# Altium project CRD25DA12N-FMC V2 (09-2024).PrjPcb (part 7 of 9)

## Sheet 07 - Current-Temp Sense.SchDoc: Current/Temp. - 25kW WolfPACK FM3 Six-Pack Inv.
size 431 x 279 mm; Date: 09/2024; DocumentNumber: CRD25DA12N-FMC; Revision: 2.0; SheetNumber: 7; SheetTotal: 9; SheetSize: B
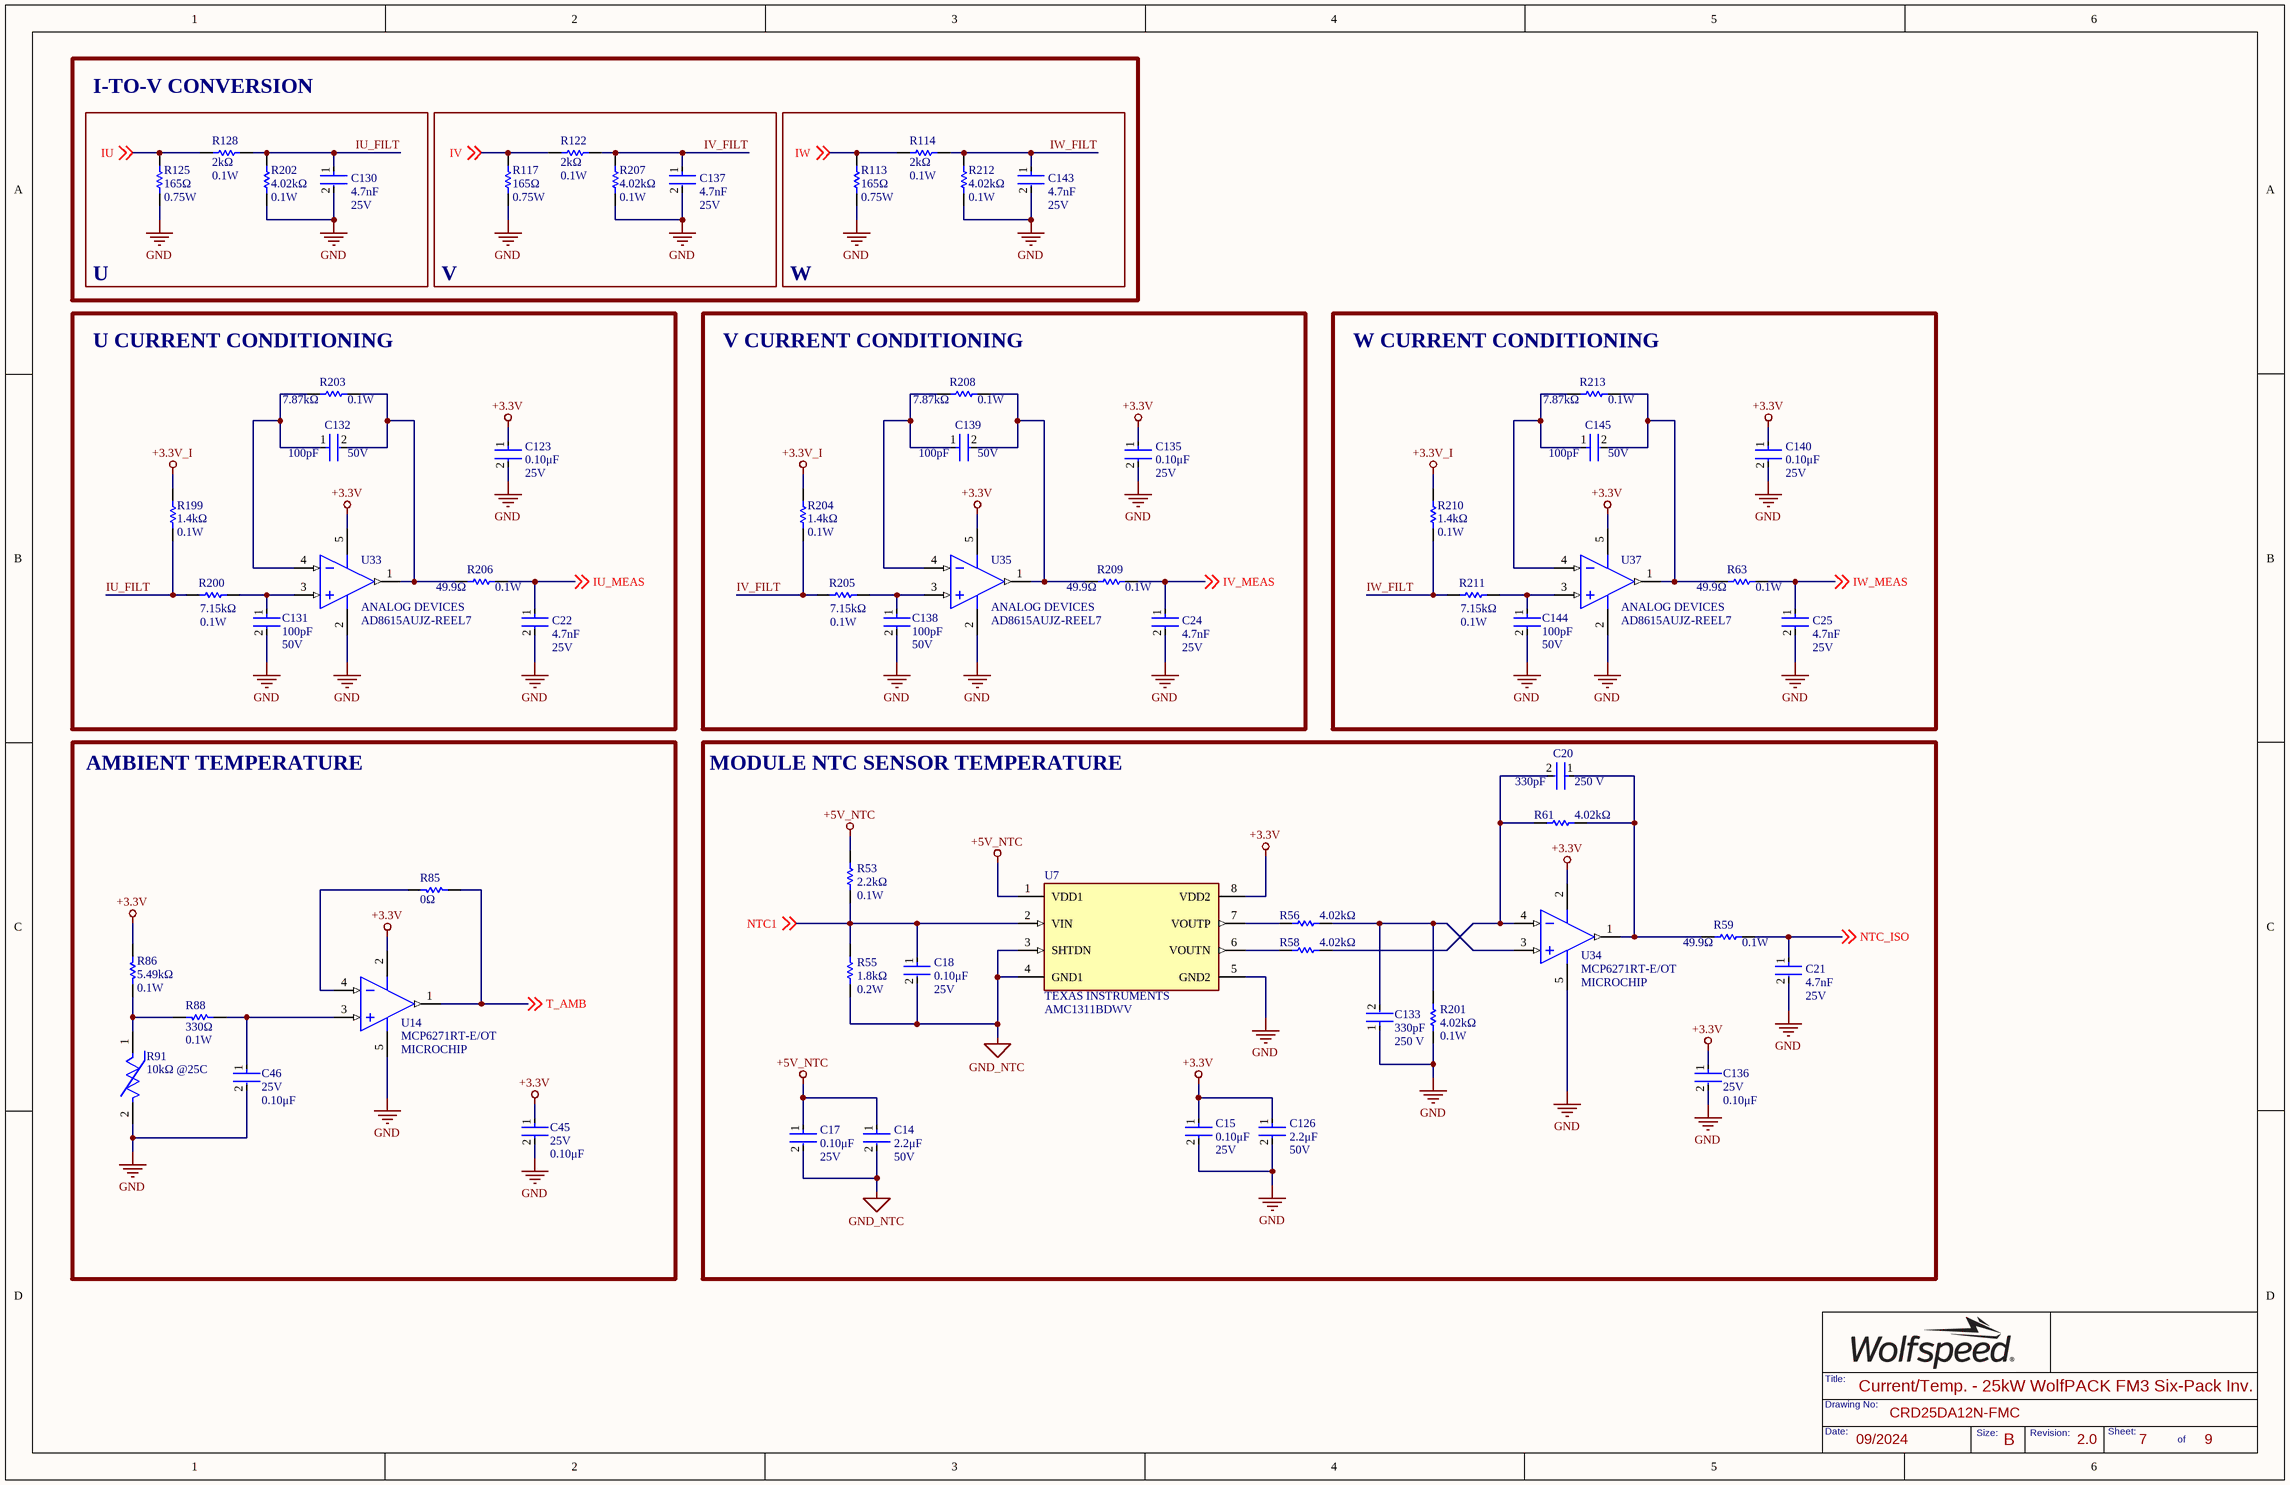
[diagram p6: 07 - Current-Temp Sense.SchDoc]

### Parts
C14  Voltage Rating: 50V  Capacitance: 2.2μF  [FP-C0603C-CF-IPC_B]  (hidden comment: GRT188R61H225ME13D)
C15  Voltage Rating: 25V  Capacitance: 0.10μF  [FP-C0603C-CF-IPC_B]  (hidden comment: C0603C104K3RACTU)
C17  Voltage Rating: 25V  Capacitance: 0.10μF  [FP-C0603C-CF-IPC_B]  (hidden comment: C0603C104K3RACTU)
C18  Voltage Rating: 25V  Capacitance: 0.10μF  [FP-C0603C-CF-IPC_B]  (hidden comment: C0603C104K3RACTU)
C20  value 330pF  Voltage Rating: 250 V  [FP-C0603C-CF-IPC_B]  (hidden comment: C0603C331JAGAC7867)
C21  Voltage Rating: 25V  Capacitance: 4.7nF  [FP-C0603C-CF-IPC_B]  (hidden comment: C0603C472K3RAC7867)
C22  Voltage Rating: 25V  Capacitance: 4.7nF  [FP-C0603C-CF-IPC_B]  (hidden comment: C0603C472K3RAC7867)
C24  Voltage Rating: 25V  Capacitance: 4.7nF  [FP-C0603C-CF-IPC_B]  (hidden comment: C0603C472K3RAC7867)
C25  Voltage Rating: 25V  Capacitance: 4.7nF  [FP-C0603C-CF-IPC_B]  (hidden comment: C0603C472K3RAC7867)
C45  Voltage Rating: 25V  Capacitance: 0.10μF  [FP-C0603C-CF-IPC_B]  (hidden comment: C0603C104K3RACTU)
C46  Voltage Rating: 25V  Capacitance: 0.10μF  [FP-C0603C-CF-IPC_B]  (hidden comment: C0603C104K3RACTU)
C123  Voltage Rating: 25V  Capacitance: 0.10μF  [FP-C0603C-CF-IPC_B]  (hidden comment: C0603C104K3RACTU)
C126  Voltage Rating: 50V  Capacitance: 2.2μF  [FP-C0603C-CF-IPC_B]  (hidden comment: GRT188R61H225ME13D)
C130  Voltage Rating: 25V  Capacitance: 4.7nF  [FP-C0603C-CF-IPC_B]  (hidden comment: C0603C472K3RAC7867)
C131  Capacitance: 100pF  Voltage: 50V  [FP-C0603C-CF-IPC_B]  (hidden comment: CL10C101JB8NNNC)
C132  Capacitance: 100pF  Voltage: 50V  [FP-C0603C-CF-IPC_B]  (hidden comment: CL10C101JB8NNNC)
C133  value 330pF  Voltage Rating: 250 V  [FP-C0603C-CF-IPC_B]  (hidden comment: C0603C331JAGAC7867)
C135  Voltage Rating: 25V  Capacitance: 0.10μF  [FP-C0603C-CF-IPC_B]  (hidden comment: C0603C104K3RACTU)
C136  Voltage Rating: 25V  Capacitance: 0.10μF  [FP-C0603C-CF-IPC_B]  (hidden comment: C0603C104K3RACTU)
C137  Voltage Rating: 25V  Capacitance: 4.7nF  [FP-C0603C-CF-IPC_B]  (hidden comment: C0603C472K3RAC7867)
C138  Capacitance: 100pF  Voltage: 50V  [FP-C0603C-CF-IPC_B]  (hidden comment: CL10C101JB8NNNC)
C139  Capacitance: 100pF  Voltage: 50V  [FP-C0603C-CF-IPC_B]  (hidden comment: CL10C101JB8NNNC)
C140  Voltage Rating: 25V  Capacitance: 0.10μF  [FP-C0603C-CF-IPC_B]  (hidden comment: C0603C104K3RACTU)
C143  Voltage Rating: 25V  Capacitance: 4.7nF  [FP-C0603C-CF-IPC_B]  (hidden comment: C0603C472K3RAC7867)
C144  Capacitance: 100pF  Voltage: 50V  [FP-C0603C-CF-IPC_B]  (hidden comment: CL10C101JB8NNNC)
C145  Capacitance: 100pF  Voltage: 50V  [FP-C0603C-CF-IPC_B]  (hidden comment: CL10C101JB8NNNC)
R53  value 2.2kΩ  Power: 0.1W  [FP-MCR03-IPC_B]  (hidden comment: RC0603FR-072K2L)
R55  Resistance: 1.8kΩ  Max Power Dissipation: 0.2W  [FP-MCR03-IPC_B]  (hidden comment: ERJ-PB3B1801V)
R56  Resistance: 4.02kΩ  [FP-MCR03-IPC_B]  (hidden comment: ERA3AEB4021V)
R58  Resistance: 4.02kΩ  [FP-MCR03-IPC_B]  (hidden comment: ERA3AEB4021V)
R59  Resistance: 49.9Ω  Power Rating: 0.1W  [FP-MCR03-IPC_B]  (hidden comment: ERJ-3EKF49R9V)
R61  Resistance: 4.02kΩ  [FP-MCR03-IPC_B]  (hidden comment: ERA3AEB4021V)
R63  Resistance: 49.9Ω  Power Rating: 0.1W  [FP-MCR03-IPC_B]  (hidden comment: ERJ-3EKF49R9V)
R85  Resistance: 0Ω  [FP-MCR03-IPC_B]  (hidden comment: CRCW06030000Z0EB)
R86  value 5.49kΩ  Power Rating: 0.1W  [FP-MCR03-IPC_B]  (hidden comment: RC0603FR-075K49L)
R88  Resistance: 330Ω  Power Rating: 0.1W  [FP-MCR03-IPC_B]  (hidden comment: RC0603FR-13330RL)
R91  value 10kΩ @25C  [FP-NCU18-0_15-IPC_B]  (hidden comment: NCU18XH103F6SRB)
R113  value 165Ω  Power: 0.75W  [FP-CRCW2010-e3-IPC_B]  (hidden comment: CRCW2010165RFKEF)
R114  Resistance: 2kΩ  Power Rating: 0.1W  [FP-MCR03-IPC_B]  (hidden comment: RT0603DRE072KL)
R117  value 165Ω  Power: 0.75W  [FP-CRCW2010-e3-IPC_B]  (hidden comment: CRCW2010165RFKEF)
R122  Resistance: 2kΩ  Power Rating: 0.1W  [FP-MCR03-IPC_B]  (hidden comment: RT0603DRE072KL)
R125  value 165Ω  Power: 0.75W  [FP-CRCW2010-e3-IPC_B]  (hidden comment: CRCW2010165RFKEF)
R128  Resistance: 2kΩ  Power Rating: 0.1W  [FP-MCR03-IPC_B]  (hidden comment: RT0603DRE072KL)
R199  value 1.4kΩ  Power: 0.1W  [FP-MCR03-IPC_B]  (hidden comment: RT0603DRD071K4L)
R200  Resistance: 7.15kΩ  Power Rating: 0.1W  [FP-MCR03-IPC_B]  (hidden comment: RMCF0603FT7K15)
R201  Power: 0.1W  Resistance: 4.02kΩ  [FP-MCR03-IPC_B]  (hidden comment: ERA3AEB4021V)
R202  Resistance: 4.02kΩ  Power Rating: 0.1W  [FP-MCR03-IPC_B]  (hidden comment: ERA3AEB4021V)
R203  Resistance: 7.87kΩ  Max Power Dissipation: 0.1W  [FP-MCR03-IPC_B]  (hidden comment: RC0603FR-077K87L)
R204  value 1.4kΩ  Power: 0.1W  [FP-MCR03-IPC_B]  (hidden comment: RT0603DRD071K4L)
R205  Resistance: 7.15kΩ  Power Rating: 0.1W  [FP-MCR03-IPC_B]  (hidden comment: RMCF0603FT7K15)
R206  Resistance: 49.9Ω  Power Rating: 0.1W  [FP-MCR03-IPC_B]  (hidden comment: ERJ-3EKF49R9V)
R207  Resistance: 4.02kΩ  Power Rating: 0.1W  [FP-MCR03-IPC_B]  (hidden comment: ERA3AEB4021V)
R208  Resistance: 7.87kΩ  Max Power Dissipation: 0.1W  [FP-MCR03-IPC_B]  (hidden comment: RC0603FR-077K87L)
R209  Resistance: 49.9Ω  Power Rating: 0.1W  [FP-MCR03-IPC_B]  (hidden comment: ERJ-3EKF49R9V)
R210  value 1.4kΩ  Power: 0.1W  [FP-MCR03-IPC_B]  (hidden comment: RT0603DRD071K4L)
R211  Resistance: 7.15kΩ  Power Rating: 0.1W  [FP-MCR03-IPC_B]  (hidden comment: RMCF0603FT7K15)
R212  Resistance: 4.02kΩ  Power Rating: 0.1W  [FP-MCR03-IPC_B]  (hidden comment: ERA3AEB4021V)
R213  Resistance: 7.87kΩ  Max Power Dissipation: 0.1W  [FP-MCR03-IPC_B]  (hidden comment: RC0603FR-077K87L)
U7  AMC1311BDWV  Manufacturer: TEXAS INSTRUMENTS  [FP-DWV0008A-MFG]
U14  Manufacturer: MICROCHIP  [ADI-UJ-5_M]  (hidden comment: MCP6271RT-E/OT)
U33  Manufacturer: ANALOG DEVICES  [ADI-UJ-5_M]  (hidden comment: AD8615AUJZ-REEL7)
U34  Manufacturer: MICROCHIP  [ADI-UJ-5_M]  (hidden comment: MCP6271RT-E/OT)
U35  Manufacturer: ANALOG DEVICES  [ADI-UJ-5_M]  (hidden comment: AD8615AUJZ-REEL7)
U37  Manufacturer: ANALOG DEVICES  [ADI-UJ-5_M]  (hidden comment: AD8615AUJZ-REEL7)

### Blocks framed on the sheet
V: C137 R117 R122 R207
W: C143 R113 R114 R212
U CURRENT CONDITIONING: C22 C123 C131 C132 R199 R200 R203 R206 U33
V CURRENT CONDITIONING: C24 C135 C138 C139 R204 R205 R208 R209 U35
W CURRENT CONDITIONING: C25 C140 C144 C145 R63 R210 R211 R213 U37
AMBIENT TEMPERATURE: C45 C46 R85 R86 R88 R91 U14
MODULE NTC SENSOR TEMPERATURE: C14 C15 C17 C18 C20 C21 C126 C133 C136 R53 R55 R56 R58 R59 R61 R201 U7 U34

### Nets
+3.3V: C15.1 C45.1 C123.1 C126.1 C135.1 C136.1 C140.1 R86.2 U7.8(VDD2) U14.2(+V) U33.5(+V) U34.2(+V) U35.5(+V) U37.5(+V)
+3.3V_I: R199.2 R204.2 R210.2
+5V_NTC: C14.1 C17.1 R53.2 U7.1(VDD1)
GND: C15.2 C21.2 C22.2 C24.2 C25.2 C45.2 C46.2 C123.2 C126.2 C130.2 C131.2 C133.1 C135.2 C136.2 C137.2 C138.2 C140.2 C143.2 C144.2 R91.2 R113.1 R117.1 R125.1 R201.2 R202.1 R207.1 R212.1 U7.5(GND2) U14.5(-V) U33.2(-V) U34.5(-V) U35.2(-V) U37.2(-V)
GND_NTC: C14.2 C17.2 C18.2 R55.1 U7.3(SHTDN) U7.4(GND1)
IU: R125.2 R128.1 ; off-sheet IU
IU_FILT: C130.1 R128.2 R199.1 R200.1 R202.2
IU_MEAS: C22.1 R206.2 ; off-sheet IU_MEAS
IV: R117.2 R122.1 ; off-sheet IV
IV_FILT: C137.1 R122.2 R204.1 R205.1 R207.2
IV_MEAS: C24.1 R209.2 ; off-sheet IV_MEAS
IW: R113.2 R114.1 ; off-sheet IW
IW_FILT: C143.1 R114.2 R210.1 R211.1 R212.2
IW_MEAS: C25.1 R63.2 ; off-sheet IW_MEAS
NTC1: C18.1 R53.1 R55.2 U7.2(VIN) ; off-sheet NTC1
NTC_ISO: C21.1 R59.2 ; off-sheet NTC_ISO
T_AMB: R85.1 U14.1(OUT) ; off-sheet T_AMB
NetC20_1: C20.1 R59.1 R61.1 U34.1(OUT)
NetC20_2: C20.2 R58.1 R61.2 U34.4(-IN)
NetC46_1: C46.1 R88.2 U14.3(+IN)
NetC131_1: C131.1 R200.2 U33.3(+IN)
NetC132_1: C132.1 R203.1 U33.4(-IN)
NetC132_2: C132.2 R203.2 R206.1 U33.1(OUT)
NetC133_2: C133.2 R56.1 R201.1 U34.3(+IN)
NetC138_1: C138.1 R205.2 U35.3(+IN)
NetC139_1: C139.1 R208.1 U35.4(-IN)
NetC139_2: C139.2 R208.2 R209.1 U35.1(OUT)
NetC144_1: C144.1 R211.2 U37.3(+IN)
NetC145_1: C145.1 R213.1 U37.4(-IN)
NetC145_2: C145.2 R63.1 R213.2 U37.1(OUT)
NetR56_2: R56.2 U7.7(VOUTP)
NetR58_2: R58.2 U7.6(VOUTN)
NetR85_2: R85.2 U14.4(-IN)
NetR86_1: R86.1 R88.1 R91.1

### Notes on the sheet
- I-TO-V CONVERSION
- U
- Title:
- Date:
- Drawing No:
- Size:
- Revision:
- Sheet:
- of

### Library data of the parts
C14 C126 = GRT188R61H225ME13D: CAP CER 2.2UF 50V X5R 0603; Manufacturer: MURATA; Tolerance: 20%; Value: 2.2μF; Supplier 1: Arrow Electronics; Manufacturer Part Number: GRT188R61H225ME13D; RoHS: Yes; Category: Ceramic Capacitors; Stock 1: 3937; Pricing 1: 1=0.29580, 10=0.20370, 25=0.18090, 100=0.12380, 250=0.12190, 500=0.10920, 1000=0.07700, 3000=0.07630 (USD); Mount: Surface Mount; Case Code (Metric): 1608; Case Code (Imperial): 0603; Min Operating Temperature: -55°C; Max Operating Temperature: 85°C; Packaging: Tape and Reel; Length: 0.063inch; Width: 0.031inch; Thickness: 0.035inch; Ratings: AEC-Q200; RoHS Compliant: Yes; ComponentLink1URL: http://search.murata.co.jp/Ceramy/image/img/A01X/G101/ENG/GRT188R61H225ME13-01.pdf?src-supplier=Digi-Key; ComponentLink1Description: http://search.murata.co.jp/Ceramy/image/img/A01X/G101/ENG/GRT188R61H225ME13-01.pdf?src-supplier=Digi-Key; ComponentLink2URL: https://search.murata.co.jp/Ceramy/image/img/A01X/G101/ENG/GRT188R61H225ME13-01.pdf?src-supplier=Digi-Key; ComponentLink2Description: https://search.murata.co.jp/Ceramy/image/img/A01X/G101/ENG/GRT188R61H225ME13-01.pdf?src-supplier=Digi-Key; Supplier Part Number 1: GRT188R61H225ME13D; Package: 0603
C15 C17 C18 C45 C46 C123 C135 C136 C140 = CMP-2006-03057-2: as C6-C9 on sheet 06 - Voltage Sense; Lead Free: Yes; Device Class L3: Ceramic Capacitors; Manufacturer Part Number: C0603C104K3RACTU; Digikey Description: CAP CER 0.1UF 25V X7R 0603; Mouser Description: Multilayer Ceramic Capacitors MLCC - SMD/SMT 25volts 0.1uF X7R 10%; Package: 0603; Temperature Range Low: -55°C; Automotive: Yes; Device Class L2: Capacitors; Octopart: https://octopart.com/c0603c104k3ractu-kemet-127541; ComponentLink2Description: Datasheet; ComponentLink2URL: https://api.kemet.com/component-edge/download/datasheet/C0603C100J5GACAUTO.pdf; Temperature Range High: +125°C; RoHS: TRUE; Device Class L1: Passive Components; Category: Cap; Temperature: -55°C to +125°C; Height: 0.87mm; Temperature Characteristic: X7R
C20 C133 = CMP-03020-020944-2: CAP CER 330PF 250V C0G/NP0 0603; Manufacturer: KEMET; Material: Ceramic; Temperature Coefficient: 30ppm/°C; Tolerance: 0.05; Automotive Grade: Grade 1; Temperature Characteristic: C0G; Octopart: https://octopart.com/c0603c331jagac7867-kemet-83501965; Manufacturer Part Number: C0603C331JAGAC7867; Height: 0.87mm; ComponentLink2URL: https://api.kemet.com/component-edge/download/datasheet/C0603C100J5GACAUTO.pdf; Capacitance: 330pF; Package: 0603; Category: Cap; Temperature Range High: +125°C; RoHS: TRUE; ComponentLink2Description: Datasheet; Automotive: Yes; Temperature Range Low: -55°C; Temperature: -55°C to +125°C; Device Class L3: Ceramic Capacitors; Device Class L2: Capacitors; Digikey Description: Cap Ceramic 330pF 250V C0G 5% SMD 0603 125°C Paper T/R; Device Class L1: Passive Components; Lead Free: Yes
C21 C22 C24 C25 C130 C137 C143 = C0603C472K3RAC7867: CAP CER 4700PF 25V 10% X7R 0603; Manufacturer: KEMET; Manufacturer Part Number: C0603C472K3RACTU; Dielectric Material: Ceramic; Value: 4.7nF; Supplier 1: Newark; RoHS: Yes; Category: Ceramic Capacitors; Stock 1: 8000; Pricing 1: 1=0.04800, 4000=0.04800 (USD); Mount: Surface Mount; Package: 0603; Case Code (Metric): 1608; Case Code (Imperial): 0603; Min Operating Temperature: -55°C; Max Operating Temperature: 125°C; Tolerance: 10%; Dielectric: X7R; Packaging: Tape and Reel; Package Quantity: 1; Voltage Rating (DC): 25V; Termination: SMD/SMT; Dissipation Factor: 10%; Series: C; Construction: Flat; Length: 1.6mm; Width: 0.031inch; Height: 0.8mm; Thickness: 0.034inch; Lead Pitch: 0.7mm; Depth: 0.8mm; Radiation Hardening: No; Reach SVHC Compliant: Yes; RoHS Compliant: Yes; ComponentLink1URL: https://datasheet.ciiva.com/5414/kem-c1002-x7r-smd-357932-5414293.pdf?src-supplier=Mouser; ComponentLink1Description: https://datasheet.ciiva.com/5414/kem-c1002-x7r-smd-357932-5414293.pdf?src-supplier=Mouser; Supplier Part Number 1: 67AH9250
C131 C132 C138 C139 C144 C145 = CL10C101JB8NNNC: CAP CER 100PF 50V C0G/NP0 0603; Manufacturer: SAMSUNG; Material: Ceramic; Tolerance: 5%; Dielectric: C0G; Temperature Coefficient: 300ppm/°C; Supplier 1: Rs; Manufacturer Part Number: CL10C101JB8NNNC; RoHS: Yes; Category: Ceramic Capacitors; Stock 1: 488000; Mount: Surface Mount; Case Code (Metric): 1608; Case Code (Imperial): 0603; Contact Plating: Tin; Min Operating Temperature: -55°C; Max Operating Temperature: 125°C; Voltage Rating (DC): 50V; Packaging: Tape and Reel; Package Quantity: 1; Voltage Rating: 50V; Series: CL; Construction: Flat; Length: 1.6mm; Width: 0.031inch; Height: 0.8mm; Depth: 0.8mm; Thickness: 0.035inch; Radiation Hardening: No; Lead Free: Lead Free; RoHS Compliant: Yes; ComponentLink1URL: https://datasheet.ciiva.com/25782/cl10c101jb8nnnc-25782145.pdf?src-supplier=Digi-Key; ComponentLink1Description: https://datasheet.ciiva.com/25782/cl10c101jb8nnnc-25782145.pdf?src-supplier=Digi-Key; ComponentLink2URL: https://datasheet.ciiva.com/26838/getdatasheetpartid-358356-26838483.pdf?src-supplier=Verical; ComponentLink2Description: https://datasheet.ciiva.com/26838/getdatasheetpartid-358356-26838483.pdf?src-supplier=Verical; ComponentLink3URL: https://datasheet.ciiva.com/29199/456574-da-01-en-vs-kondensator-0603-29199002.pdf?src-supplier=Conrad; ComponentLink3Description: https://datasheet.ciiva.com/29199/456574-da-01-en-vs-kondensator-0603-29199002.pdf?src-supplier=Conrad; ComponentLink4URL: https://datasheet.ciiva.com/26310/mlcc-catalogdownload2013-eng-26310303.pdf?src-supplier=Distrelec; ComponentLink4Description: https://datasheet.ciiva.com/26310/mlcc-catalogdownload2013-eng-26310303.pdf?src-supplier=Distrelec; Supplier Part Number 1: 7665130; Package: 0603; Value: 100pF
R53 = RC0603FR-072K2L: RES 2.2K OHM 1% 1/10W 0603; Manufacturer: YAGEO; Package: 0603; Manufacturer Part Number: RC0603FR-072K2L
R55 = ERJ-PB3B1801V: RES SMD 1.8K OHM 0.1% 1/5W 0603; Manufacturer: PANASONIC; Temperature Coefficient: 50ppm/°C; Value: 1.8kΩ; Supplier 1: Arrow Electronics; Manufacturer Part Number: ERJ-PB3B1801V; RoHS: Yes; Category: Chip SMD Resistors; Stock 1: 7475; Pricing 1: 1=0.24860, 10=0.21250, 25=0.15580, 100=0.08750, 250=0.07800, 500=0.04680, 1000=0.02760, 3000=0.02730, 6000=0.02700 (USD); Package: 0603; Case Code (Metric): 1608; Case Code (Imperial): 0603; Min Operating Temperature: -55°C; Max Operating Temperature: 155°C; Packaging: Tape and Reel; Resistor Type: Thick Film; Number of Terminations: 2; Tolerance: 0.1%; Features: Automotive AEC-Q200; Length: 0.063inch; Width: 0.032inch; Height - Seated (Max): 0.022inch; ComponentLink1URL: https://industrial.panasonic.com/sa/system/files/data/download/catalog/id_fixed-resistors_e_2.pdf?src-supplier=Digi-Key; ComponentLink1Description: https://industrial.panasonic.com/sa/system/files/data/download/catalog/id_fixed-resistors_e_2.pdf?src-supplier=Digi-Key; Supplier Part Number 1: ERJ-PB3B1801V
R56 R58 R61 R202 R207 R212 = ERA3AEB4021V: RES SMD 4.02KOHM 0.1% 1/10W 0603; Manufacturer: PANASONIC; Manufacturer Part Number: ERA-3AEB4021V; Voltage Rating: 75V; Temperature Coefficient: 25ppm/°C; Max Power Dissipation: 100mW; Value: 4.02kΩ; Supplier 1: Rs; RoHS: Yes; Category: Chip SMD Resistors; Stock 1: 890; Mount: Surface Mount; Package: 0603; Number of Pins: 2; Case Code (Metric): 1608; Case Code (Imperial): 0603; Contact Plating: Tin; Min Operating Temperature: -55°C; Max Operating Temperature: 155°C; Tolerance: 0.1%; Packaging: Tape and Reel; Package Quantity: 1; Resistor Type: Thin Film; Number of Terminations: 2; Termination: SMD/SMT; Voltage Rating (DC): 75V; Features: Automotive AEC-Q200; Series: ERA-3A; Construction: Rectangular; Resistance Tolerance: 0.1%; Technology: METAL FILM; Length: 1.6mm; Width: 0.8mm; Height: 0.45mm; Depth: 0.8mm; Radiation Hardening: No; Reach SVHC Compliant: Yes; Military Standard: Not; Lead Free: Lead Free; RoHS Compliant: Yes; ComponentLink1URL: https://datasheet.ciiva.com/29183/452377-da-01-en-widerstand-0603-era-29183994.pdf?src-supplier=Conrad; ComponentLink1Description: https://datasheet.ciiva.com/29183/452377-da-01-en-widerstand-0603-era-29183994.pdf?src-supplier=Conrad; ComponentLink2URL: https://datasheet.ciiva.com/5968/485442-5968885.pdf?src-supplier=Farnell; ComponentLink2Description: https://datasheet.ciiva.com/5968/485442-5968885.pdf?src-supplier=Farnell; ComponentLink3URL: https://datasheet.ciiva.com/5968/485442-5968886.pdf?src-supplier=Farnell; ComponentLink3Description: https://datasheet.ciiva.com/5968/485442-5968886.pdf?src-supplier=Farnell; ComponentLink4URL: https://datasheet.ciiva.com/43457/485442-43457053.pdf?src-supplier=Farnell; ComponentLink4Description: https://datasheet.ciiva.com/43457/485442-43457053.pdf?src-supplier=Farnell; ComponentLink5URL: https://datasheet.ciiva.com/46388/485442-46388217.pdf?src-supplier=Element14; ComponentLink5Description: https://datasheet.ciiva.com/46388/485442-46388217.pdf?src-supplier=Element14; Supplier Part Number 1: 7087616
R59 R63 R206 R209 = ERJ-3EKF49R9V: RES SMD 49.9 OHM 1% 1/10W 0603; Manufacturer: PANASONIC; Temperature Coefficient: 100ppm/°C; Voltage Rating: 75V; Max Power Dissipation: 100mW; Voltage Rating (DC): 50V; Working Voltage: 6V; Value: 49.9Ω; Supplier 1: Newark; Manufacturer Part Number: ERJ-3EKF49R9V; RoHS: Yes; Category: Chip SMD Resistors; Stock 1: 670000; Pricing 1: 1=0.00600, 5000=0.00600 (USD); Mount: Surface Mount; Package: 0603; Contact Plating: Tin; Case Code (Imperial): 0603; Case Code (Metric): 1608; Min Operating Temperature: -55°C; Max Operating Temperature: 155°C; Tolerance: 1%; Resistor Type: Thick Film; Packaging: Tape and Reel; Package Quantity: 5000; Number of Terminations: 2; Termination: SMD/SMT; Features: Automotive AEC-Q200; Series: ERJ; Resistance Tolerance: 1%; Construction: Rectangular; Technology: THICK FILM; Length: 1.6mm; Width: 0.8mm; Height: 0.022inch; Depth: 0.8mm; Radiation Hardening: No; Reach SVHC Compliant: Yes; Military Standard: Not; Lead Free: Lead Free; RoHS Compliant: Yes; ComponentLink1URL: https://datasheet.ciiva.com/46388/1678782-46388908.pdf?src-supplier=Element14; ComponentLink1Description: https://datasheet.ciiva.com/46388/1678782-46388908.pdf?src-supplier=Element14; ComponentLink2URL: https://datasheet.ciiva.com/28694/1678782-28694219.pdf?src-supplier=Element14; ComponentLink2Description: https://datasheet.ciiva.com/28694/1678782-28694219.pdf?src-supplier=Element14; ComponentLink3URL: https://datasheet.ciiva.com/16772/70260748-16772570.pdf?src-supplier=Allied+Electronics; ComponentLink3Description: https://datasheet.ciiva.com/16772/70260748-16772570.pdf?src-supplier=Allied+Electronics; ComponentLink4URL: https://datasheet.ciiva.com/16766/70260748-16766262.pdf?src-supplier=Allied+Electronics; ComponentLink4Description: https://datasheet.ciiva.com/16766/70260748-16766262.pdf?src-supplier=Allied+Electronics; ComponentLink5URL: https://datasheet.ciiva.com/9117/aoa0000ce2-9117128.pdf?src-supplier=Avnet; ComponentLink5Description: https://datasheet.ciiva.com/9117/aoa0000ce2-9117128.pdf?src-supplier=Avnet; ComponentLink6URL: https://datasheet.ciiva.com/48531/aoa0000ce2-48531019.pdf?src-supplier=Avnet; ComponentLink6Description: https://datasheet.ciiva.com/48531/aoa0000ce2-48531019.pdf?src-supplier=Avnet; ComponentLink7URL: https://datasheet.ciiva.com/30095/aoa0000ce2-30095355.pdf?src-supplier=Onlinecomponents.com; ComponentLink7Description: https://datasheet.ciiva.com/30095/aoa0000ce2-30095355.pdf?src-supplier=Onlinecomponents.com; Supplier Part Number 1: 12AC1058
R85 = CRCW06030000Z0EB: RES SMD 0 OHM JUMPER 1/10W 0603; Manufacturer: VISHAY DALE; Manufacturer Part Number: CRCW06030000Z0EBC; Max Power Dissipation: 100mW; Voltage Rating: 75V; Tolerance: 1%; Temperature Coefficient: 100ppm/°C; Value: 0Ω; Supplier 1: Newark; RoHS: Yes; Category: Chip SMD Resistors; Stock 1: 110000; Pricing 1: 1=0.00300, 10000=0.00300 (USD); Package: 0603; Number of Pins: 2; Case Code (Imperial): 0603; Case Code (Metric): 1608; Weight: 7.1E-05oz; Contact Plating: Tin; Size Code: 0603; Min Operating Temperature: -55°C; Max Operating Temperature: 155°C; Packaging: Tape and Reel; Resistor Type: Thick Film; Number of Terminations: 2; Features: Automotive AEC-Q200; Package Quantity: 10000; Termination: SMD/SMT; Voltage Rating (DC): 75V; Series: CRCW; Construction: Rectangular; Technology: THICK FILM; Length: 1.55mm; Width: 0.033inch; Height: 0.45mm; Depth: 0.85mm; Ratings: AEC-Q200; Radiation Hardening: No; RoHS Compliant: Yes; Lead Free: Lead Free; Military Standard: Not; ComponentLink1URL: https://datasheet.ciiva.com/11808/0900766b80d98afc-11808678.pdf?src-supplier=Rs; ComponentLink1Description: https://datasheet.ciiva.com/11808/0900766b80d98afc-11808678.pdf?src-supplier=Rs; ComponentLink2URL: https://datasheet.ciiva.com/2563/dcrcwe3-2563949.pdf?src-supplier=Digi-Key; ComponentLink2Description: https://datasheet.ciiva.com/2563/dcrcwe3-2563949.pdf?src-supplier=Digi-Key; ComponentLink3URL: https://datasheet.ciiva.com/5550/dcrcwe3-109170-5550748.pdf?src-supplier=Mouser; ComponentLink3Description: https://datasheet.ciiva.com/5550/dcrcwe3-109170-5550748.pdf?src-supplier=Mouser; ComponentLink4URL: https://datasheet.ciiva.com/16430/dcrcwe3-16430060.pdf?src-supplier=Future+Electronics; ComponentLink4Description: https://datasheet.ciiva.com/16430/dcrcwe3-16430060.pdf?src-supplier=Future+Electronics; ComponentLink5URL: https://datasheet.ciiva.com/7791/dcrcwe3-7791992.pdf?src-supplier=Element14; ComponentLink5Description: https://datasheet.ciiva.com/7791/dcrcwe3-7791992.pdf?src-supplier=Element14; Supplier Part Number 1: 48P7902
R86 = RC0603FR-075K49L: RES 5.49K OHM 1% 1/10W 0603; Manufacturer: YAGEO; Temperature Coefficient: 100ppm/°C; Voltage Rating: 50V; Max Power Dissipation: 100mW; Supplier 1: Future Electronics; Manufacturer Part Number: RC0603FR-075K49L; RoHS: Yes; Category: Chip SMD Resistors; Stock 1: 1425000; Pricing 1: 5000=0.0015, 50000=0.0014, 150000=0.0014, 375000=0.0013, 1000000=0.0012 (USD); Case/Package: 0603; Case Code (Imperial): 0603; Case Code (Metric): 1608; Size Code: 0603; Min Operating Temperature: -55°C; Max Operating Temperature: 155°C; Tolerance: 1%; Packaging: Tape and Reel; Resistance: 5.49kΩ; Series: RC; Number of Terminations: 2; Termination: SMD/SMT; Package Quantity: 5000; Voltage Rating (DC): 50V; Features: Moisture Resistant; Length: 1.6mm; Width: 0.8mm; Height: 0.45mm; RoHS Compliant: Yes; Lead Free: 5697LeadFree; ComponentLink1URL: https://datasheet.ciiva.com/2454/pyu-r-int-thick-7-2454378.pdf?src-supplier=Digikey; ComponentLink1Description: https://datasheet.ciiva.com/2454/pyu-r-int-thick-7-2454378.pdf?src-supplier=Digikey; ComponentLink2URL: https://datasheet.ciiva.com/2454/pyu-r-int-thick-7-2454379.pdf?src-supplier=Digikey; ComponentLink2Description: https://datasheet.ciiva.com/2454/pyu-r-int-thick-7-2454379.pdf?src-supplier=Digikey; ComponentLink3URL: https://datasheet.ciiva.com/2454/pyu-r-int-thick-7-2454380.pdf?src-supplier=Digikey; ComponentLink3Description: https://datasheet.ciiva.com/2454/pyu-r-int-thick-7-2454380.pdf?src-supplier=Digikey; ComponentLink4URL: https://datasheet.ciiva.com/12558/rc0603-272842-12558872.pdf?src-supplier=Mouser; ComponentLink4Description: https://datasheet.ciiva.com/12558/rc0603-272842-12558872.pdf?src-supplier=Mouser; Supplier Part Number 1: 1172345; Package: 0603
R88 = RC0603FR-13330RL: RES 330 OHM 1% 1/10W 0603; Manufacturer: YAGEO; Voltage Rating: 50V; Temperature Coefficient: 100ppm/°C; Value: 330Ω; Supplier 1: Future Electronics; Manufacturer Part Number: RC0603FR-13330RL; RoHS: Yes; Category: Chip SMD Resistors; Stock 1: 560000; Pricing 1: 20000=0.00130, 80000=0.00120, 400000=0.00120, 800000=0.00110, 2500000=0.00110 (USD); Package: 0603; Case Code (Imperial): 0603; Case Code (Metric): 1608; Min Operating Temperature: -55°C; Max Operating Temperature: 155°C; Tolerance: 1%; Packaging: Tape and Reel; Resistor Type: Thick Film; Termination: SMD/SMT; Series: RC; Construction: Rectangular; Length: 1.6mm; Width: 0.8mm; Height: 0.45mm; Depth: 0.8mm; Military Standard: Not; RoHS Compliant: Yes; ComponentLink1URL: https://datasheet.ciiva.com/12561/rc0603-272842-12561430.pdf?src-supplier=Mouser; ComponentLink1Description: https://datasheet.ciiva.com/12561/rc0603-272842-12561430.pdf?src-supplier=Mouser; Supplier Part Number 1: 4067719
R91 = CMP-06022-000547-2: THERMISTOR NTC 10KOHM 3380K 0603; Manufacturer: MURATA; Min Operating Temperature: -40°C; Case Code (Metric): 1608; Max Operating Temperature: 150°C; RoHS Compliant: Yes; Package: 0603; Case Code (Imperial): 0603; REACH SVHC: No SVHC; Manufacturer Part Number: NCU18XH103F6SRB
R113 R117 R125 = CRCW2010165RFKEF: RES SMD 165 OHM 1% 3/4W 2010; Manufacturer: VISHAY; Package: 2010; Manufacturer Part Number: CRCW2010165RFKEF
R114 R122 R128 = RT0603DRE072KL: RES SMD 2K OHM 0.5% 1/10W 0603; Manufacturer: YAGEO; Temperature Coefficient: 50ppm/°C; Voltage Rating: 75V; Max Power Dissipation: 100mW; Voltage Rating (DC): 50V; Value: 2kΩ; Supplier 1: Future Electronics; Manufacturer Part Number: RT0603DRE072KL; RoHS: Yes; Category: Chip SMD Resistors; Stock 1: 5000; Pricing 1: 5000=0.00650, 20000=0.00620, 75000=0.00590, 125000=0.00580, 250000=0.00550 (USD); Package: 0603; Contact Plating: Tin,Matte; Case Code (Metric): 1608; Case Code (Imperial): 0603; Min Operating Temperature: -55°C; Max Operating Temperature: 125°C; Tolerance: 0.5%; Resistor Type: Thin Film; Packaging: Tape and Reel; Package Quantity: 5000; Number of Terminations: 2; Termination: SMD/SMT; Features: Moisture Resistant; Series: RT; Construction: Rectangular; Length: 0.063inch; Width: 0.031inch; Height: 0.022inch; Depth: 0.8mm; Radiation Hardening: No; Military Standard: Not; Lead Free: Lead Free; RoHS Compliant: Yes; ComponentLink1URL: https://datasheet.ciiva.com/2566/pyu-rt-1-to-0-05-rohs-l-5-2566187.pdf?src-supplier=Digi-Key; ComponentLink1Description: https://datasheet.ciiva.com/2566/pyu-rt-1-to-0-05-rohs-l-5-2566187.pdf?src-supplier=Digi-Key; ComponentLink2URL: https://datasheet.ciiva.com/12705/pyu-rt-1-to-0-05-rohs-l-4-12705391.pdf?src-supplier=Mouser; ComponentLink2Description: https://datasheet.ciiva.com/12705/pyu-rt-1-to-0-05-rohs-l-4-12705391.pdf?src-supplier=Mouser; Supplier Part Number 1: 6165116
R199 R204 R210 = RT0603DRD071K4L: RES SMD 1.4K OHM 0.5% 1/10W 0603; Manufacturer: YAGEO; Manufacturer Part Number: RT0603DRD071K4L; Package: 0603
R200 R205 R211 = RMCF0603FT7K15: RES 7.15K OHM 1% 1/10W 0603; Manufacturer: STACKPOLE; Max Power Dissipation: 100mW; Temperature Coefficient: 100ppm/°C; Value: 7.15kΩ; Supplier 1: Avnet; Manufacturer Part Number: RMCF0603FT7K15; RoHS: Yes; Category: Chip SMD Resistors; Stock 1: 135000; Pricing 1: 5000=0.00280, 10000=0.00276, 20000=0.00272, 30000=0.00268, 40000=0.00264, 50000=0.00260, 500000=0.00256 (USD); Mount: Surface Mount; Package: 0603; Case Code (Metric): 1608; Case Code (Imperial): 0603; Contact Plating: Tin,Matte; Size Code: 0603; Min Operating Temperature: -55°C; Max Operating Temperature: 155°C; Tolerance: 1%; Packaging: Tape and Reel; Resistor Type: Thick Film; Number of Terminations: 2; Features: Automotive AEC-Q200; Series: RMCF; Length: 0.061inch; Width: 0.031inch; Height: 0.022inch; Radiation Hardening: No; Lead Free: Lead Free; RoHS Compliant: Yes; ComponentLink1URL: http://components.arrow.com/part/dataview/46949454S9067612N1174?src-supplier=Arrow+Electronics; ComponentLink1Description: http://components.arrow.com/part/dataview/46949454S9067612N1174?src-supplier=Arrow+Electronics; ComponentLink2URL: https://www.seielect.com/catalog/SEI-RMCF_RMCP.pdf?src-supplier=Avnet; ComponentLink2Description: https://www.seielect.com/catalog/SEI-RMCF_RMCP.pdf?src-supplier=Avnet; ComponentLink3URL: https://www.seielect.com/catalog/SEI-Packaging.pdf?src-supplier=Digi-Key; ComponentLink3Description: https://www.seielect.com/catalog/SEI-Packaging.pdf?src-supplier=Digi-Key; ComponentLink4URL: http://www.seielect.com/Catalog/SEI-RMC.pdf?src-supplier=Future+Electronics; ComponentLink4Description: http://www.seielect.com/Catalog/SEI-RMC.pdf?src-supplier=Future+Electronics; Supplier Part Number 1: RMCF0603FT7K15
R201 = ERA3AEB4021V: RES SMD 4.02KOHM 0.1% 1/10W 0603; Manufacturer: PANASONIC; Manufacturer Part Number: ERA-3AEB4021V; Voltage Rating: 75V; Temperature Coefficient: 25ppm/°C; Value: 4.02kΩ; Supplier 1: Rs; RoHS: Yes; Category: Chip SMD Resistors; Stock 1: 890; Mount: Surface Mount; Package: 0603; Number of Pins: 2; Case Code (Metric): 1608; Case Code (Imperial): 0603; Contact Plating: Tin; Min Operating Temperature: -55°C; Max Operating Temperature: 155°C; Tolerance: 0.1%; Packaging: Tape and Reel; Package Quantity: 1; Resistor Type: Thin Film; Number of Terminations: 2; Termination: SMD/SMT; Voltage Rating (DC): 75V; Features: Automotive AEC-Q200; Series: ERA-3A; Construction: Rectangular; Resistance Tolerance: 0.1%; Technology: METAL FILM; Length: 1.6mm; Width: 0.8mm; Height: 0.45mm; Depth: 0.8mm; Radiation Hardening: No; Reach SVHC Compliant: Yes; Military Standard: Not; Lead Free: Lead Free; RoHS Compliant: Yes; ComponentLink1URL: https://datasheet.ciiva.com/29183/452377-da-01-en-widerstand-0603-era-29183994.pdf?src-supplier=Conrad; ComponentLink1Description: https://datasheet.ciiva.com/29183/452377-da-01-en-widerstand-0603-era-29183994.pdf?src-supplier=Conrad; ComponentLink2URL: https://datasheet.ciiva.com/5968/485442-5968885.pdf?src-supplier=Farnell; ComponentLink2Description: https://datasheet.ciiva.com/5968/485442-5968885.pdf?src-supplier=Farnell; ComponentLink3URL: https://datasheet.ciiva.com/5968/485442-5968886.pdf?src-supplier=Farnell; ComponentLink3Description: https://datasheet.ciiva.com/5968/485442-5968886.pdf?src-supplier=Farnell; ComponentLink4URL: https://datasheet.ciiva.com/43457/485442-43457053.pdf?src-supplier=Farnell; ComponentLink4Description: https://datasheet.ciiva.com/43457/485442-43457053.pdf?src-supplier=Farnell; ComponentLink5URL: https://datasheet.ciiva.com/46388/485442-46388217.pdf?src-supplier=Element14; ComponentLink5Description: https://datasheet.ciiva.com/46388/485442-46388217.pdf?src-supplier=Element14; Supplier Part Number 1: 7087616
R203 R208 R213 = RC0603FR-077K87L: RES 7.87K OHM 1% 1/10W 0603; Manufacturer: YAGEO; Power Rating: 100mW; Temperature Coefficient: 100ppm/°C; Voltage Rating: 50V; Value: 7.87kΩ; Supplier 1: Newark; Manufacturer Part Number: RC0603FR-077K87L; RoHS: Yes; Category: Chip SMD Resistors; Stock 1: 12340; Pricing 1: 1=0.10000, 25=0.02000, 50=0.01500, 100=0.00900 (USD); Package: 0603; Case Code (Metric): 1608; Case Code (Imperial): 0603; Size Code: 0603; Min Operating Temperature: -55°C; Max Operating Temperature: 155°C; Tolerance: 1%; Series: RC; Package Quantity: 1; Packaging: Tape and Reel; Resistor Type: Thick Film; Number of Terminations: 2; Termination: SMD/SMT; Voltage Rating (DC): 50V; Features: Moisture Resistant; Construction: Rectangular; Length: 1.6mm; Width: 0.031inch; Height: 0.022inch; Depth: 0.8mm; RoHS Compliant: Yes; Military Standard: Not; Lead Free: Lead Free; ComponentLink1URL: https://datasheet.ciiva.com/2553/pyu-r-int-thick-7-2553552.pdf?src-supplier=Digi-Key; ComponentLink1Description: https://datasheet.ciiva.com/2553/pyu-r-int-thick-7-2553552.pdf?src-supplier=Digi-Key; ComponentLink2URL: https://datasheet.ciiva.com/2553/pyu-r-int-thick-7-2553553.pdf?src-supplier=Digi-Key; ComponentLink2Description: https://datasheet.ciiva.com/2553/pyu-r-int-thick-7-2553553.pdf?src-supplier=Digi-Key; ComponentLink3URL: https://datasheet.ciiva.com/2553/pyu-r-int-thick-7-2553551.pdf?src-supplier=Digi-Key; ComponentLink3Description: https://datasheet.ciiva.com/2553/pyu-r-int-thick-7-2553551.pdf?src-supplier=Digi-Key; Supplier Part Number 1: 49AK2736
U7 = CMP-04893-000001-1: IC ISOLATION 8SOIC; Input Offset Voltage: -1.1mV; Standoff Height: 0.36mm; Max Junction Temp: +150°C; Number Of Channels: 1; Input Bias Current: 0.0035uA; Max Supply Voltage: 5.5V; Min Supply Voltage: 3V; Nominal Supply Current: 1.3-7100uA; Temperature Range Low: -55°C; Device Class L3: unset; RoHS: TRUE; Digikey Description: IC ISOLATION 8SOIC; Lead Free: Yes; Device Class L1: Integrated Circuits (ICs); Manufacturer Part Number: AMC1311BDWV; ComponentLink2URL: http://www.ti.com/lit/ds/symlink/amc1311.pdf; Height: 2.8mm; Octopart: https://octopart.com/amc1311bdwv-texas+instruments-88030782; Device Class L2: Linear ICs; Ambient Temperature Range Low: -40°C; Category: IC; Ipc Land Pattern Name: SOIC127P1150X280-8; ComponentLink2Description: Datasheet; Temperature: -55°C to +125°C; Ambient Temperature Range High: +125°C; Automotive: No; Mouser Description: Isolated Amplifier High-Impedance 2V Input Reinforced 3V to 5.5V 8-Pin SOIC Tube; Temperature Range High: +125°C; Package: DWV0008A; Value: N/A
U14 U34 = MCP6271RT-E/OT: IC OPAMP GP 1 CIRCUIT SOT23-5; Value: N/A; Case/Package: SOT-23-5; Manufacturer Part Number: MCP6271RT-E/OT
U33 U35 U37 = CMP-0384-02059-2: IC OPAMP GP 1 CIRCUIT TSOT23-5; Generic Part Number: AD8615; Iq/Amp: 1.7mA; V Span Max: 6V; Amplifiers Per Package: 1; Small Signal Bandwidth: 23MHz; Input Offset Voltage: 80uV; V Span Min: 2.7V; Slew Rate: 12V/us; Input Bias Current: 200fA; ComponentLink4URL: http://www.analog.com/en/all-operational-amplifiers-op-amps/operational-amplifiers-op-amps/ad8615/products/product.html#product-recommendations; DatasheetVersion: Rev. E; Code_JEDEC: MO-193-AB; ComponentLink3Description: Package Specification; PackageDescription: 5-Pin Thin Small Outline Transistor Package, Body 2.9 x 1.6 mm, Pitch 0.95 mm; ComponentLink4Description: Reference Circuit; RevisionNote: Reference Circuit URL fixed; ComponentLink1Description: Manufacturer URL; PartNumber: AD8615AUJZ-REEL7; Mounting Technology: Surface Mount; ComponentLink3URL: http:/www.analog.com/static/imported-files/packages/PKG_PDF/TSOT(UJ)/UJ_5.pdf; ComponentLink2URL: http://www.analog.com/static/imported-files/data_sheets/AD8615_8616_8618.pdf; PackageVersion: 100708-A; ComponentLink1URL: http://www.analog.com/en/index.html; ComponentLink2Description: Datasheet; PackageReference: UJ-5; Manufacturer Part Number: AD8615AUJZ-REEL7; Package: TSOT-23-5; Value: N/A